# Altium schematic sheet Squib_Managment.SchDoc: Squib Management
size 203 x 127 mm; DrawnBy: Kace Chandler; DocumentNumber: 9; SheetNumber: 9; SheetTotal: 23
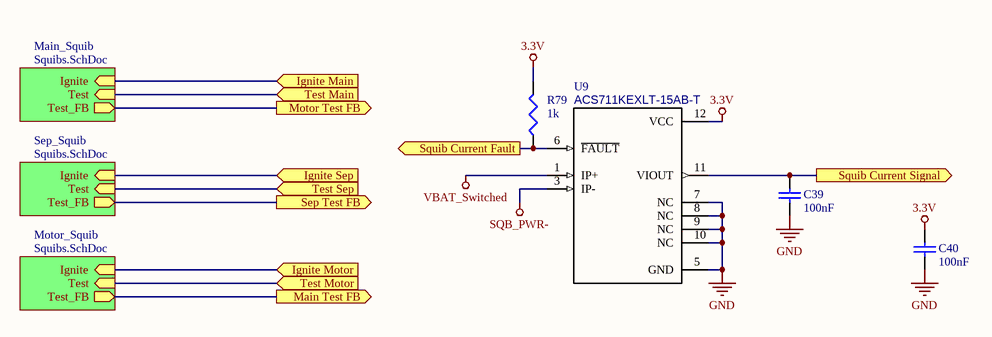
[diagram p0: Squib_Managment.SchDoc]

## Parts
C39  value 100nF  [0805 Footprint]  (hidden comment: Cap)
C40  value 100nF  [0805 Footprint]  (hidden comment: Cap)
R79  value 1k  (hidden comment: Res3)
U9  ACS711KEXLT-15AB-T  [*SENSOR_ACS711KEXLT-15AB-T]

## Sub-sheets
Main_Squib = Squibs.SchDoc: Ignite (in), Test (in), Test_FB (out)
Motor_Squib = Squibs.SchDoc: Ignite (in), Test (in), Test_FB (out)
Sep_Squib = Squibs.SchDoc: Ignite (in), Test (in), Test_FB (out)

## Ports
Ignite Main (in), Ignite Motor (in), Ignite Sep (in), Main Test FB (out), Motor Test FB (out), Sep Test FB (out), Squib Current Fault (out), Squib Current Signal (out), Test Main (in), Test Motor (in), Test Sep (in)

## Nets
3.3V: C40.2 R79.2 U9.12(VCC)
GND: C39.1 C40.1 U9.5(GND) U9.7(NC) U9.8(NC) U9.9(NC) U9.10(NC)
SQB_PWR-: U9.3(IP-)
VBAT_Switched: U9.1(IP+)
Ignite Main: port Ignite Main, sheet Main_Squib/Ignite
Ignite Motor: port Ignite Motor, sheet Motor_Squib/Ignite
Ignite Sep: port Ignite Sep, sheet Sep_Squib/Ignite
Main Test FB: port Main Test FB, sheet Motor_Squib/Test_FB
Motor Test FB: port Motor Test FB, sheet Main_Squib/Test_FB
Sep Test FB: port Sep Test FB, sheet Sep_Squib/Test_FB
Squib Current Fault: R79.1 U9.6(~{FAULT}) ; port Squib Current Fault
Squib Current Signal: C39.2 U9.11(VIOUT) ; port Squib Current Signal
Test Main: port Test Main, sheet Main_Squib/Test
Test Motor: port Test Motor, sheet Motor_Squib/Test
Test Sep: port Test Sep, sheet Sep_Squib/Test

## Library data of the parts
C39 C40 = Cap: Capacitor; Published: 8-Jun-2000; LatestRevisionDate: 17-Jul-2002; LatestRevisionNote: Re-released for DXP Platform.; PackageReference: RAD-0.3; Publisher: Altium Limited; PackageDescription: Radial Cap, Thru-Hole; 2 Leads; 0.3 in Pin Spacing
R79 = Res3: Resistor; Published: 8-Jun-2000; LatestRevisionDate: 29-May-2009; LatestRevisionNote: IPC-7351 Footprint Added.; PackageReference: J1-0603; Publisher: Altium Limited; PackageDescription: Chip Resistor
U9 = 31A current sensor: Hall Effect Linear Current Sensor with Overcurrent Fault Output for <100 V Isolation Applications; MF: Allegro MicroSystems LLC; Package: PowerWFQFN-12 Allegro MicroSystems LLC; Price: None; SnapEDA_Link: https://www.snapeda.com/parts/ACS711KEXLT-15AB-T/Allegro%20MicroSystems%20LLC/view-part/?ref=snap; MP: ACS711KEXLT-15AB-T; Availability: Unavailable; Value: *; Supplier 1: Digi-Key; Supplier Part Number 1: 620-1481-1-ND